# Altium schematic sheet mcu.SchDoc
size A4
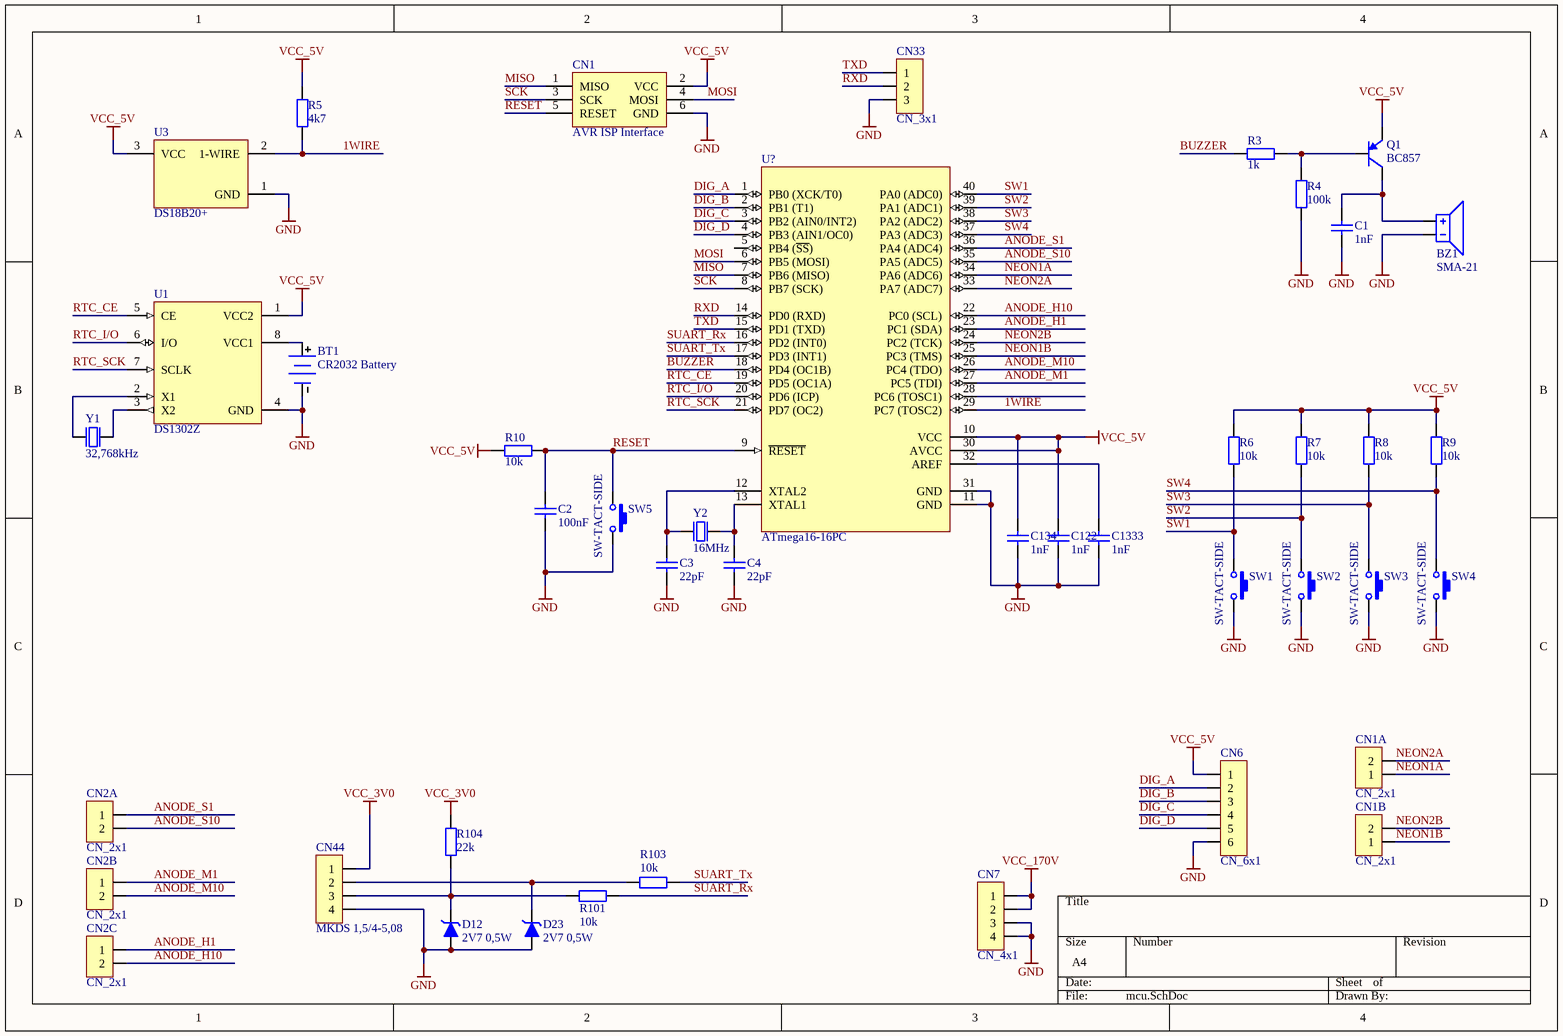
[diagram p0: mcu.SchDoc]

## Parts
BT1  CR2032 Battery  [SN2032]
BZ1  SMA-21  [SMA-21 P10]
C1  1nF  [C0805]
C2  100nF  [C0805]
C3  22pF  [C0805]
C4  22pF  [C0805]
C122  1nF  [C0805]
C134  1nF  [C0805]
C1333  1nF  [C0805]
CN1  AVR ISP Interface  [IDC6_RA]
CN1A  CN_2x1  [GP_2x1]
CN1B  CN_2x1  [GP_2x1]
CN2A  CN_2x1  [GP_2x1]
CN2B  CN_2x1  [GP_2x1]
CN2C  CN_2x1  [GP_2x1]
CN6  CN_6x1  [GP_6x1]
CN7  CN_4x1  [GP_4x1]
CN33  CN_3x1  [GP_3x1H]
CN44  MKDS 1,5/4-5,08  [MKDS 1,5/4-5,08]
D12  2V7 0,5W  [MiniMELF]
D23  2V7 0,5W  [MiniMELF]
Q1  BC857  [SOT-23]
R3  1k  [R0805]
R4  100k  [R0805]
R5  4k7  [R0805]
R6  10k  [R0805]
R7  10k  [R0805]
R8  10k  [R0805]
R9  10k  [R0805]
R10  10k  [R0805]
R101  10k  [R0805]
R103  10k  [R0805]
R104  22k  [R0805]
SW1  SW-TACT-SIDE  [TACT_SO_THT]
SW2  SW-TACT-SIDE  [TACT_SO_THT]
SW3  SW-TACT-SIDE  [TACT_SO_THT]
SW4  SW-TACT-SIDE  [TACT_SO_THT]
SW5  SW-TACT-SIDE  [TACT_SO_THT]
U1  DS1302Z  [SO8]
U3  DS18B20+  [TO-92D]
U?  ATmega16-16PC  [DIP40]
Y1  32,768kHz  [85SMX]
Y2  16MHz  [HC49-S]

## Nets
GND: BT1.2(-) BZ1.2 C1.1 C2.1 C3.1 C4.1 C122.1 C134.1 C1333.1 CN1.6(GND) CN6.6 CN7.3 CN7.4 CN33.3 CN44.4 D12.1(A) D23.1(A) R4.1 SW1.2 SW1.3 SW1.4 SW2.2 SW2.3 SW2.4 SW3.2 SW3.3 SW3.4 SW4.2 SW4.3 SW4.4 SW5.2 SW5.3 SW5.4 U1.4(GND) U3.1(GND) U?.11(GND) U?.31(GND)
VCC_3V0: CN44.1 R104.1
VCC_5V: C122.2 C134.2 CN1.2(VCC) CN6.1 Q1.2(E) R5.2 R6.2 R7.2 R8.2 R9.2 R10.2 U1.1(VCC2) U3.3(VCC) U?.10(VCC) U?.30(AVCC)
VCC_170V: CN7.1 CN7.2
1WIRE: R5.1 U3.2(1-WIRE) U?.29(PC7_(TOSC2))
ANODE_H1: CN2C.1 U?.23(PC1_(SDA))
ANODE_H10: CN2C.2 U?.22(PC0_(SCL))
ANODE_M1: CN2B.1 U?.27(PC5_(TDI))
ANODE_M10: CN2B.2 U?.26(PC4_(TDO))
ANODE_S1: CN2A.1 U?.36(PA4_(ADC4))
ANODE_S10: CN2A.2 U?.35(PA5_(ADC5))
BUZZER: R3.2 U?.18(PD4_(OC1B))
DIG_A: CN6.2 U?.1(PB0_(XCK/T0))
DIG_B: CN6.3 U?.2(PB1_(T1))
DIG_C: CN6.4 U?.3(PB2_(AIN0/INT2))
DIG_D: CN6.5 U?.4(PB3_(AIN1/OC0))
MISO: CN1.1(MISO) U?.7(PB6_(MISO))
MOSI: CN1.4(MOSI) U?.6(PB5_(MOSI))
NEON1A: CN1A.1 U?.34(PA6_(ADC6))
NEON1B: CN1B.1 U?.25(PC3_(TMS))
NEON2A: CN1A.2 U?.33(PA7_(ADC7))
NEON2B: CN1B.2 U?.24(PC2_(TCK))
RESET: C2.2 CN1.5(RESET) R10.1 SW5.1 U?.9(~{RESET})
RTC_CE: U1.5(CE) U?.19(PD5_(OC1A))
RTC_I/O: U1.6(I/O) U?.20(PD6_(ICP))
RTC_SCK: U1.7(SCLK) U?.21(PD7_(OC2))
RXD: CN33.2 U?.14(PD0_(RXD))
SCK: CN1.3(SCK) U?.8(PB7_(SCK))
SUART_Rx: R101.1 U?.16(PD2_(INT0))
SUART_Tx: R103.1 U?.17(PD3_(INT1))
SW1: R6.1 SW1.1 U?.40(PA0_(ADC0))
SW2: R7.1 SW2.1 U?.39(PA1_(ADC1))
SW3: R8.1 SW3.1 U?.38(PA2_(ADC2))
SW4: R9.1 SW4.1 U?.37(PA3_(ADC3))
TXD: CN33.1 U?.15(PD1_(TXD))
NetBT1_1: BT1.1(+) U1.8(VCC1)
NetBZ1_1: BZ1.1 C1.2 Q1.3(C)
NetC3_2: C3.2 U?.12(XTAL2) Y2.1(OSC1)
NetC4_2: C4.2 U?.13(XTAL1) Y2.2(OSC2)
NetC1333_2: C1333.2 U?.32(AREF)
NetCN44_2: CN44.2 D23.2(K) R103.2
NetCN44_3: CN44.3 D12.2(K) R101.2 R104.2
NetQ1_1: Q1.1(B) R3.1 R4.2
NetU1_2: U1.2(X1) Y1.1(OSC1)
NetU1_3: U1.3(X2) Y1.2(OSC2)

Not connected (* = marked no-connect by the designer): U? 5(PB4_(~{SS})) 28(PC6_(TOSC1))

## Library data of the parts
BZ1 = SMA21: Sonitron 21mm Piezo Buzzer
C1-C4 C122 C134 C1333 = Cap: Capacitor; ComponentLink1Description: datasheet; ComponentLink2Description: supplier
  C1 C122 C134 C1333: Value: 1nF
  C2: Value: 100nF
  C3 C4: Value: 22pF
CN1 = AVR ISP Interface: ISP Programming Header for AVR MCU's
D12 D23 = BZV55C2V7: Zener Diode 2V7, 0,5W
Q1 = BC857: PNP General Purpose Transistor (VCE=-45V, IC=-100mA)
R3-R10 R101 R103 R104 = Res: Resistor; Published: 19-Feb-2006; ComponentLink1Description: datasheet; ComponentLink2Description: supplier
  R3: Value: 1k
  R4: Value: 100k
  R5: Value: 4k7
  R6-R10 R101 R103: Value: 10k
  R104: Value: 22k
SW1-SW5 = SW-TACT-SIDE: Side-operated Tactile Switch; Published: 30-Jun-2006
U1 = DS1302Z: Trickle-Charge Timekeeping Chip
U3 = DS18B20+: DS18B20+ (TO92) 1-Wire Digital Thermometer
U? = ATmega16-16PC: 8-Bit AVR Microcontroller with 16K Bytes of In-System Programmable Flash Memory; Package Information: Latest Revision: Dec-1999; Published: 17-Sep-2003; Datasheet: Latest Revision: 2466E-AVR-10/02; Package Reference: 40P6; Publisher: Altium Limited
Y1 = Clock XTAL: Crystal Clock Oscillator; ComponentLink1Description: datasheet; ComponentLink2Description: supplier; Value: 32,768kHz
Y2 = XTAL: Crystal Oscillator; ComponentLink1Description: datasheet; ComponentLink2Description: supplier; Value: 16MHz
BT1 = CR2032 Battery: Published: 24-Mar-1999; Revision: July-2002: Re-released for DXP Platform.; Publisher: Altium Limited